# EAGLE schematic LA-3A (EAGLE 9.6.2)
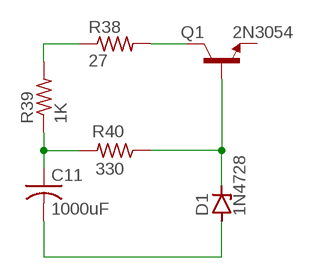
[diagram p0: schematic, sheet 1]

## Parts
C11  1000uF  C-US025-024X044  [C025-024X044]
D1  1N4728  [DO41Z10]
Q1  2N3054  [TO66]
R38  27  R-US_0204/7  [0204/7]
R39  1K  R-US_0204/7  [0204/7]
R40  330  R-US_0204/7  [0204/7]

## Nets
N$1: R38.1 R39.2
N$2: C11.1 R39.1 R40.2
N$3: D1.C Q1.2(B) R40.1
N$4: Q1.3(C) Q1.TO66(C) R38.2
N$5: C11.2 D1.A
Unconnected: Q1.1(E)

## Library data of the parts
C11 = rcl:C-US: CAPACITOR, American symbol; SPICEPREFIX: C
D1 = diode:1N4728: Z DIODE 3.3 V, 1W, 5 percent
Q1 = transistor-npn:2N3054: NPN Transistor
R38-R40 = rcl:R-US_: RESISTOR, American symbol; SPICEPREFIX: R